# EAGLE design 12_SHR_New (EAGLE 7.5.0)
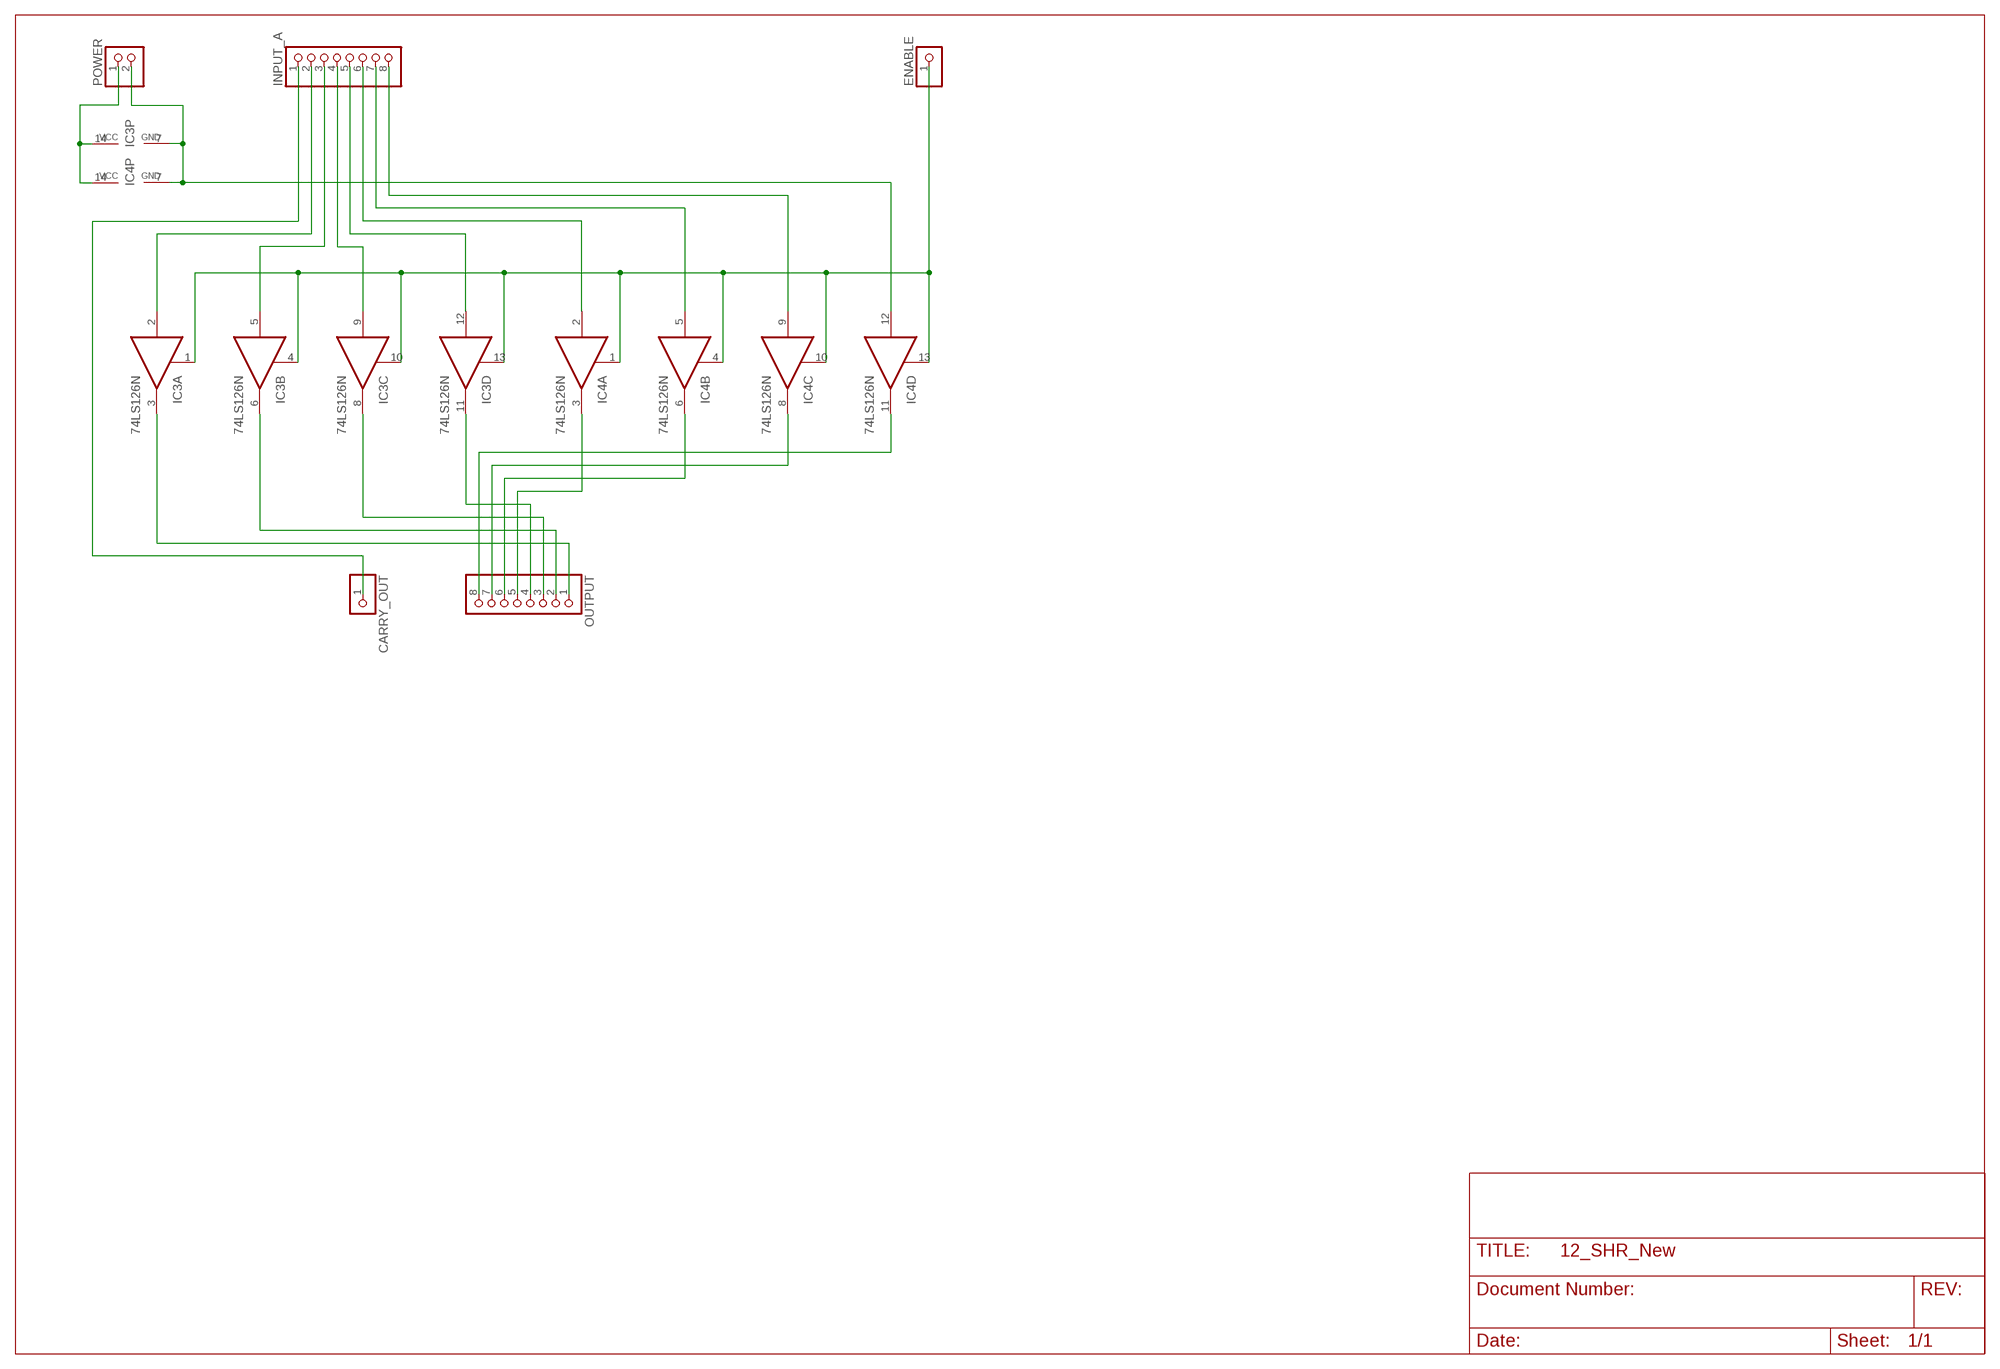
[diagram p0: schematic, sheet 1]

## Parts
CARRY_OUT  PINHD-1X1  [1X01]
ENABLE  PINHD-1X1  [1X01]
IC3  74LS126N  [DIL14]
IC4  74LS126N  [DIL14]
INPUT_A  PINHD-1X8  [1X08]
OUTPUT  PINHD-1X8  [1X08]
POWER  PINHD-1X2  [1X02]

## Nets
GND: IC3.7(P:GND) IC4.7(P:GND) IC4.12(D:I) POWER.2
N$2: CARRY_OUT.1 INPUT_A.1
N$3: IC3.2(A:I) INPUT_A.2
N$6: IC3.12(D:I) INPUT_A.5
N$7: IC4.2(A:I) INPUT_A.6
N$8: IC4.5(B:I) INPUT_A.7
N$11: IC4.9(C:I) INPUT_A.8
N$20: IC3.5(B:I) INPUT_A.3
N$21: IC3.9(C:I) INPUT_A.4
N$25: IC3.3(A:O) OUTPUT.1
N$26: IC3.6(B:O) OUTPUT.2
N$27: IC3.8(C:O) OUTPUT.3
N$28: IC3.11(D:O) OUTPUT.4
N$29: IC4.3(A:O) OUTPUT.5
N$30: IC4.6(B:O) OUTPUT.6
N$31: IC4.8(C:O) OUTPUT.7
N$32: IC4.11(D:O) OUTPUT.8
N$33: ENABLE.1 IC3.1(A:OE) IC3.4(B:OE) IC3.10(C:OE) IC3.13(D:OE) IC4.1(A:OE) IC4.4(B:OE) IC4.10(C:OE) IC4.13(D:OE)
VCC: IC3.14(P:VCC) IC4.14(P:VCC) POWER.1

## Library data of the parts
CARRY_OUT ENABLE = pinhead:PINHD-1X1: PIN HEADER
IC3 IC4 = 74xx-eu:74*126: Quad bus BUFFER, 3-state
INPUT_A OUTPUT = pinhead:PINHD-1X8: PIN HEADER
POWER = pinhead:PINHD-1X2: PIN HEADER

## Board
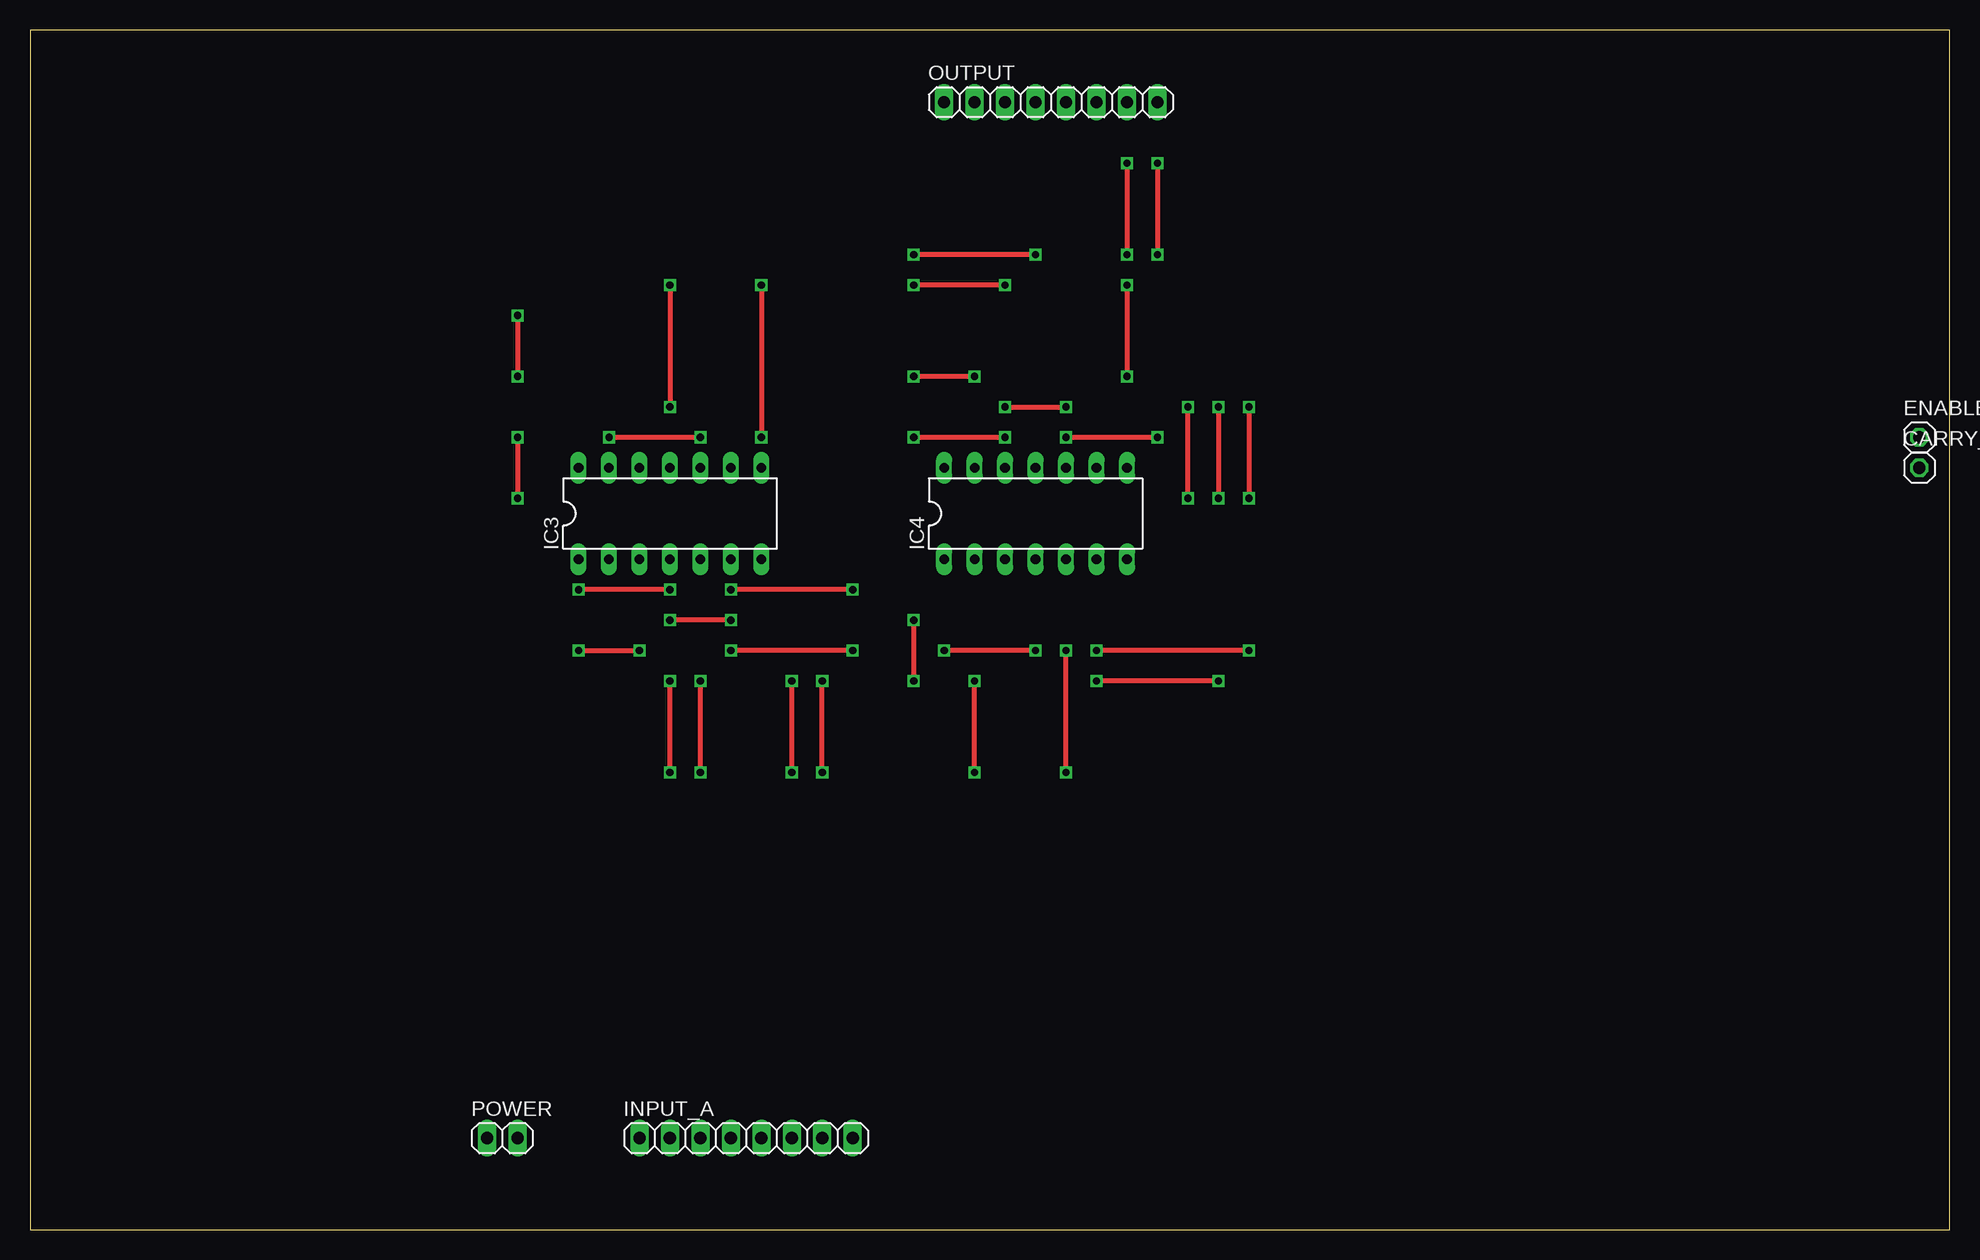
[diagram p1: board, top side]
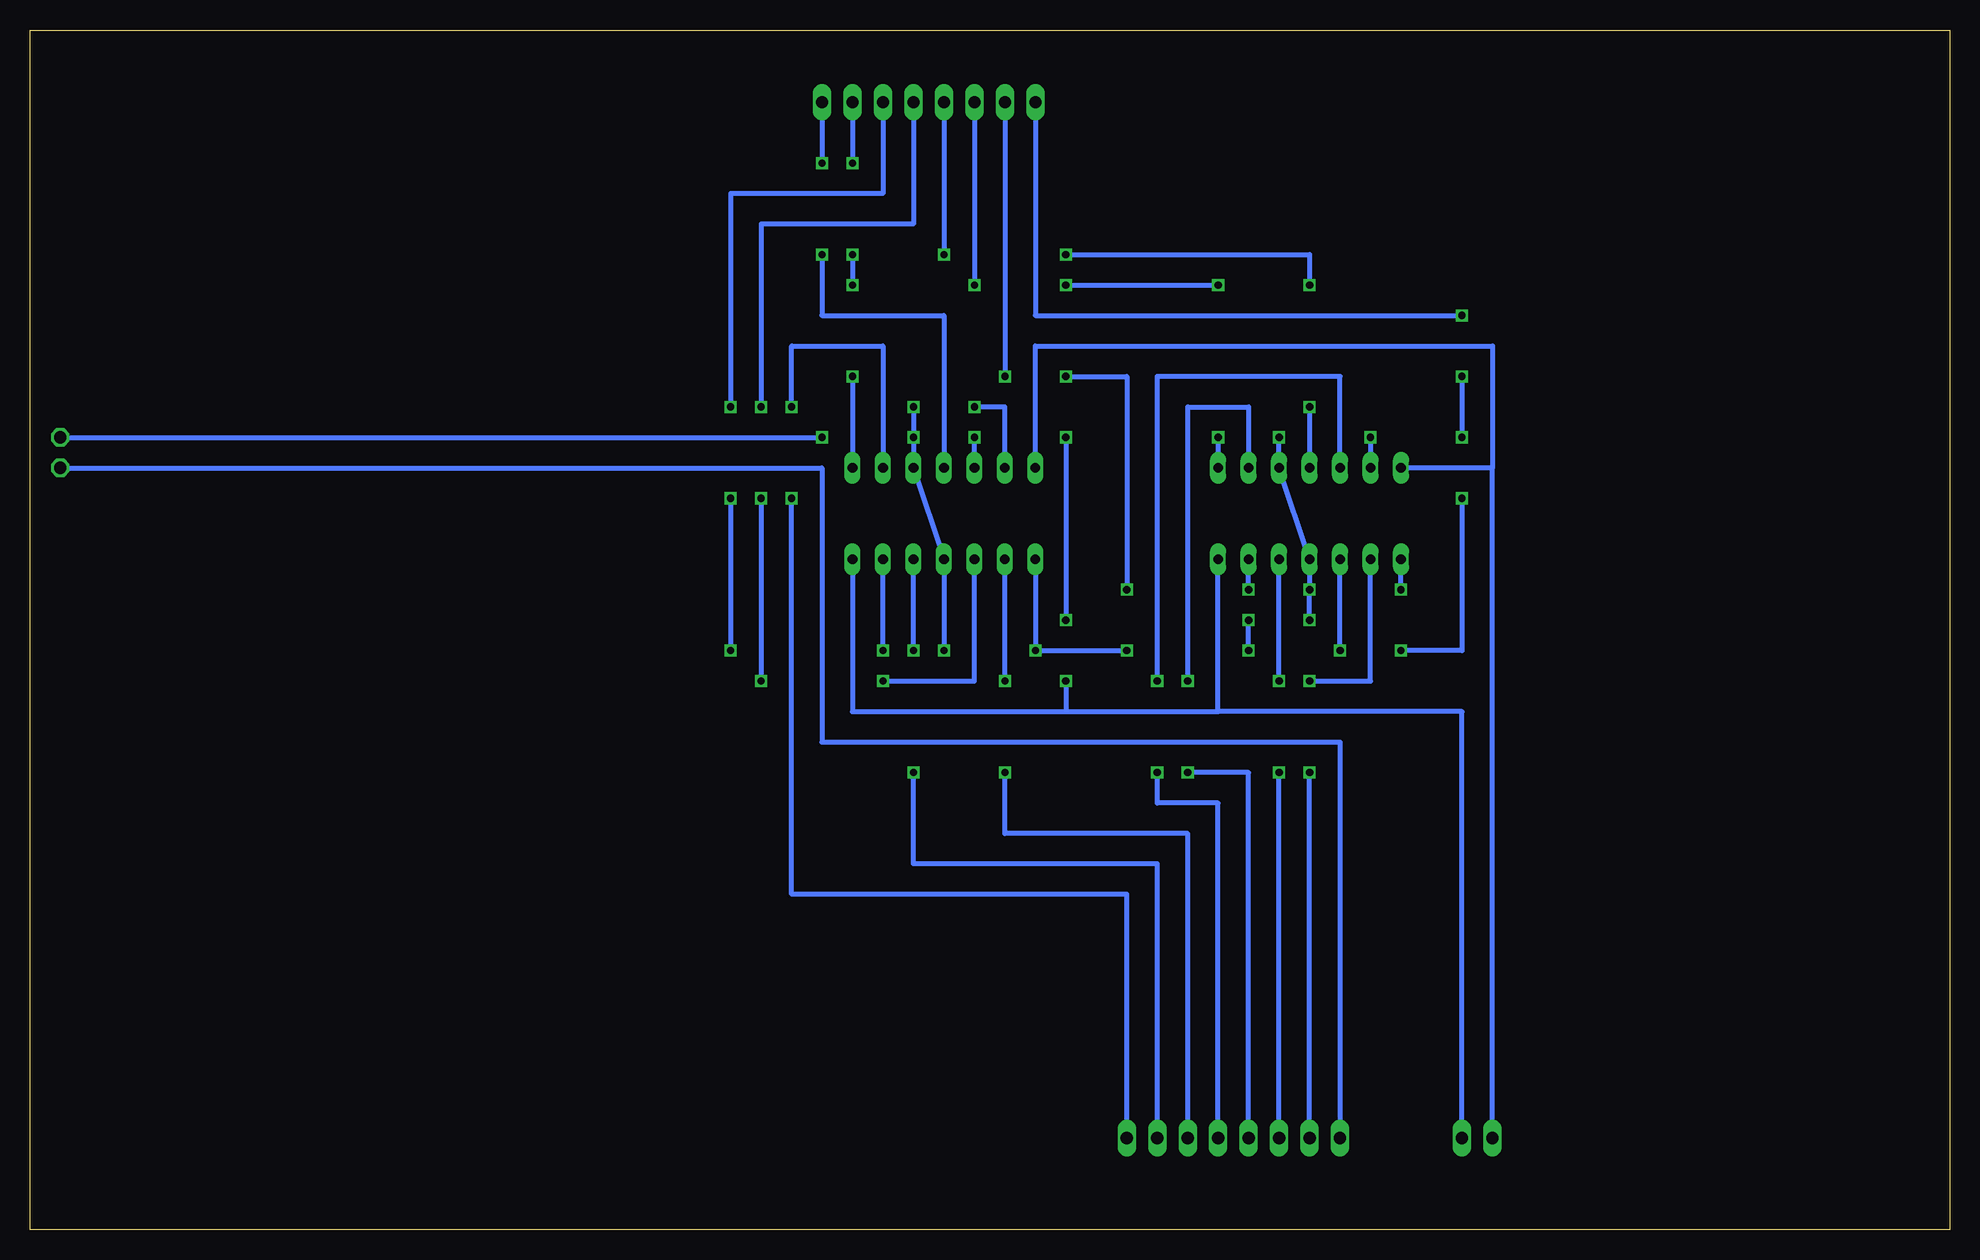
[diagram p2: board, bottom side, seen from below]

Size 160 x 100 mm. Coordinates in mm from the lower left corner, seen from the top.
Outline: 0,0 160,0 160,100 0,100 0,0
Copper layers (1*16): Top 0.035mm / dielectric 1.5mm / Bottom 0.035mm
Design rules "default": minimum track width 10mil, minimum drill 24mil, track to track 8mil, track to pad 8mil, pad to pad 8mil, via to via 8mil, smd to smd 8mil, copper to edge 40mil, drill to drill 8mil, minimum pad ring 10mil, minimum via ring 8mil, stop-mask expansion 4mil, vias tented up to drill 0mil, thermal gap 10mil

### Footprints (pad centres in the part's own frame; a part is rotated, then mirrored left to right if it is on the bottom)
1X01 = drill 1.016 octagon: 1 0,0
DIL14 = drill 0.813 long: 1 -7.62,-3.81; 2 -5.08,-3.81; 3 -2.54,-3.81; 4 0,-3.81; 5 2.54,-3.81; 6 5.08,-3.81; 7 7.62,-3.81; 8 7.62,3.81; 9 5.08,3.81; 10 2.54,3.81; 11 0,3.81; 12 -2.54,3.81; 13 -5.08,3.81; 14 -7.62,3.81
1X08 = drill 1.016 long: 1 -8.89,0; 2 -6.35,0; 3 -3.81,0; 4 -1.27,0; 5 1.27,0; 6 3.81,0; 7 6.35,0; 8 8.89,0
1X02 = drill 1.016 long: 1 -1.27,0; 2 1.27,0

### Placement (x,y rotation side)
CARRY_OUT  157.48,63.5 0 top
ENABLE  157.48,66.04 0 top
IC3  53.34,59.69 0 top
IC4  83.82,59.69 0 top
INPUT_A  59.69,7.62 0 top
OUTPUT  85.09,93.98 0 top
POWER  39.37,7.62 0 top

### Tracks (layer width: path | path; a pad name or v marks a point on that pad's centre or on a via)
GND  (via drill 0.6)
  Top 0.406: v81.28,66.04 v73.66,66.04 | v73.66,50.8 v73.66,45.72
  Bottom 0.406: POWER.2 40.64,43.18 60.96,43.18 | 60.96,43.18 IC3.7 | IC4.7 91.44,43.18 73.66,43.18 | 73.66,43.18 60.96,43.18 | IC4.12 v81.28,66.04 | v73.66,66.04 v73.66,50.8 | v73.66,45.72 73.66,43.18
N$2
  Bottom 0.406: CARRY_OUT.1 93.98,63.5 93.98,40.64 50.8,40.64 INPUT_A.1
N$3  (via drill 0.6)
  Top 0.406: v53.34,38.1 v53.34,45.72
  Bottom 0.406: INPUT_A.2 v53.34,38.1 | v53.34,45.72 48.26,45.72 IC3.2
N$6  (via drill 0.6)
  Top 0.406: v66.04,38.1 v66.04,45.72
  Bottom 0.406: INPUT_A.5 60.96,35.56 66.04,35.56 v66.04,38.1 | v66.04,45.72 66.04,71.12 50.8,71.12 IC3.12
N$7  (via drill 0.6)
  Top 0.406: v78.74,38.1 v78.74,45.72
  Bottom 0.406: INPUT_A.6 63.5,33.02 78.74,33.02 v78.74,38.1 | v78.74,45.72 IC4.2
N$8  (via drill 0.6)
  Top 0.406: v86.36,38.1 v86.36,48.26
  Bottom 0.406: INPUT_A.7 66.04,30.48 86.36,30.48 v86.36,38.1 | v86.36,48.26 IC4.5
N$11  (via drill 0.6)
  Top 0.406: v96.52,60.96 v96.52,68.58
  Bottom 0.406: INPUT_A.8 68.58,27.94 96.52,27.94 v96.52,60.96 | v96.52,68.58 96.52,73.66 88.9,73.66 IC4.9
N$20  (via drill 0.6)
  Top 0.406: v55.88,38.1 v55.88,45.72
  Bottom 0.406: INPUT_A.3 v55.88,38.1 | v55.88,45.72 IC3.5
N$21  (via drill 0.6)
  Top 0.406: v63.5,38.1 v63.5,45.72
  Bottom 0.406: v63.5,38.1 58.42,38.1 INPUT_A.4 | v63.5,45.72 63.5,68.58 58.42,68.58 IC3.9
N$25  (via drill 0.6)
  Top 0.406: v40.64,76.2 v40.64,71.12 | v40.64,66.04 v40.64,60.96 | v45.72,48.26 v50.8,48.26
  Bottom 0.406: OUTPUT.1 76.2,76.2 v40.64,76.2 | v40.64,71.12 v40.64,66.04 | v40.64,60.96 40.64,48.26 v45.72,48.26 | v50.8,48.26 IC3.3
N$26  (via drill 0.6)
  Top 0.406: v78.74,71.12 v73.66,71.12 | v68.58,53.34 v58.42,53.34
  Bottom 0.406: OUTPUT.2 v78.74,71.12 | v73.66,71.12 68.58,71.12 v68.58,53.34 | v58.42,53.34 IC3.6
N$27  (via drill 0.6)
  Top 0.406: v81.28,78.74 v73.66,78.74 | v60.96,78.74 v60.96,66.04
  Bottom 0.406: OUTPUT.3 v81.28,78.74 | v73.66,78.74 v60.96,78.74 | v60.96,66.04 IC3.8
N$28  (via drill 0.6)
  Top 0.406: v83.82,81.28 v73.66,81.28 | v53.34,78.74 v53.34,68.58
  Bottom 0.406: OUTPUT.4 v83.82,81.28 | v73.66,81.28 53.34,81.28 v53.34,78.74 | v53.34,68.58 IC3.11
N$29  (via drill 0.6)
  Top 0.406: v99.06,68.58 v99.06,60.96 | v99.06,45.72 v88.9,45.72
  Bottom 0.406: OUTPUT.5 86.36,83.82 99.06,83.82 v99.06,68.58 | v99.06,60.96 v99.06,45.72 | v88.9,45.72 81.28,45.72 IC4.3
N$30  (via drill 0.6)
  Top 0.406: v101.6,68.58 v101.6,60.96 | v101.6,48.26 v88.9,48.26
  Bottom 0.406: OUTPUT.6 88.9,86.36 101.6,86.36 v101.6,68.58 | v101.6,60.96 v101.6,48.26 | v88.9,48.26 IC4.6
N$31  (via drill 0.6)
  Top 0.406: v91.44,88.9 v91.44,81.28 | v91.44,78.74 v91.44,71.12
  Bottom 0.406: OUTPUT.7 v91.44,88.9 | v91.44,81.28 v91.44,78.74 | v91.44,71.12 IC4.8
N$32  (via drill 0.6)
  Top 0.406: v93.98,88.9 v93.98,81.28
  Bottom 0.406: OUTPUT.8 v93.98,88.9 | v93.98,81.28 93.98,76.2 83.82,76.2 IC4.11
N$33  (via drill 0.6)
  Top 0.406: v93.98,66.04 v86.36,66.04 | v81.28,68.58 v86.36,68.58 | v83.82,48.26 v76.2,48.26 | v53.34,53.34 v45.72,53.34 | v55.88,66.04 v48.26,66.04 | v68.58,48.26 v58.42,48.26 | v58.42,50.8 v53.34,50.8
  Bottom 0.406: ENABLE.1 v93.98,66.04 | v86.36,66.04 IC4.10 | IC4.10 IC4.4 v83.82,48.26 | IC4.13 78.74,68.58 v81.28,68.58 | v86.36,68.58 IC4.10 | v45.72,53.34 IC3.1 | v55.88,66.04 IC3.10 IC3.4 v53.34,53.34 v53.34,50.8 | v48.26,66.04 IC3.13 | IC4.1 v76.2,48.26 v68.58,48.26 | v58.42,48.26 v58.42,50.8
VCC
  Bottom 0.406: POWER.1 38.1,63.5 | 38.1,63.5 IC3.14 | IC4.14 76.2,73.66 38.1,73.66 38.1,63.5